# EAGLE design boiler25 (EAGLE 6.1)
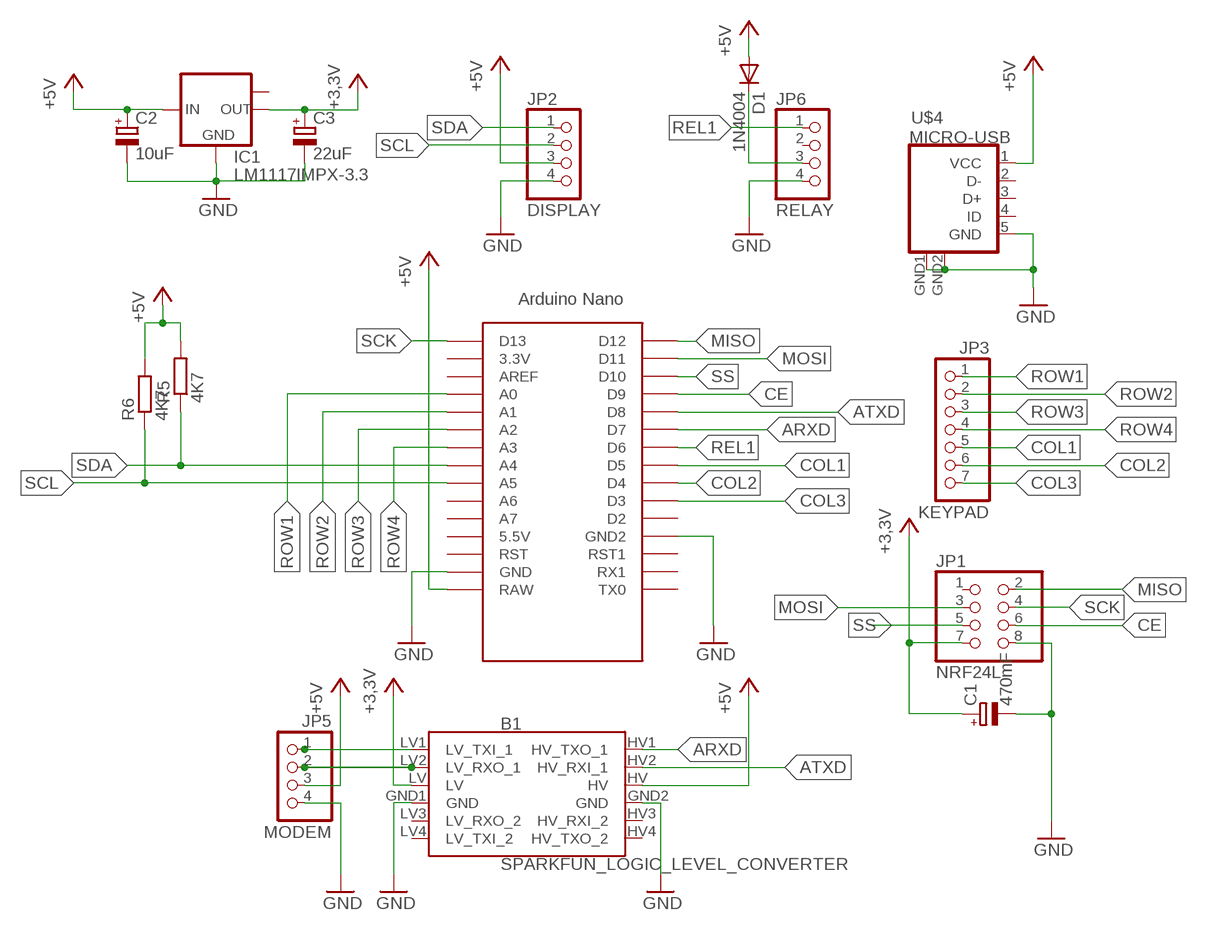
[diagram p0: schematic, sheet 1]

## Parts
B1  SPARKFUN_LOGIC_LEVEL_CONVERTER  [SPARKFUN_LOGIC_LEVEL_CONVERTER]
C1  470mF  CPOL-EUE3.5-8  [E3,5-8]
C2  10uF  CPOL-EUE1.8-4  [E1,8-4]
C3  22uF  CPOL-EUE1.8-4  [E1,8-4]
D1  1N4004  [DO41-10]
IC1  LM1117IMPX-3.3  [SOT223]
JP1  NRF24L  PINHD-2X4  [2X04]
JP2  DISPLAY  PINHD-1X4  [1X04]
JP3  KEYPAD  PINHD-1X7  [1X07]
JP5  MODEM  PINHD-1X4  [1X04]
JP6  RELAY  PINHD-1X4  [1X04]
R5  4K7  R-EU_M1206  [M1206]
R6  4K7  R-EU_M1206  [M1206]
U$4  MICRO-USB  [MICRO-USB]
U$5  NANO  [NANO]

## Nets
+3,3V: B1.LV C1.+ C3.+ IC1.2(OUT) JP1.7
+5V: B1.HV C2.+ D1.A IC1.3(IN) JP2.3 JP5.3 R5.2 R6.2 U$4.1(VCC) U$5.RAW
ARXD: B1.HV1(HV_TXO_1) U$5.D7
ATXD: B1.HV2(HV_RXI_1) U$5.D8
CE: JP1.6 U$5.D9
COL1: JP3.5 U$5.D5
COL2: JP3.6 U$5.D4
COL3: JP3.7 U$5.D3
GND: B1.GND1(GND) B1.GND2(GND) C1.- C2.- C3.- IC1.1(GND) JP1.8 JP2.4 JP5.4 JP6.4 U$4.5(GND) U$4.GND1(GND) U$4.GND2(GND) U$5.GND U$5.GND1(GND2)
MISO: JP1.2 U$5.D12
MOSI: JP1.3 U$5.D11
N$1: B1.LV1(LV_TXI_1) JP5.1
N$2: D1.C JP6.3
N$9: B1.LV2(LV_RXO_1) JP5.2
REL1: JP6.1 U$5.D6
ROW1: JP3.1 U$5.A0
ROW2: JP3.2 U$5.A1
ROW3: JP3.3 U$5.A2
ROW4: JP3.4 U$5.A3
SCK: JP1.4 U$5.D13
SCL: JP2.2 R6.1 U$5.A5
SDA: JP2.1 R5.1 U$5.A4
SS: JP1.5 U$5.D10
Unconnected: B1.HV3(HV_RXI_2) B1.HV4(HV_TXO_2) B1.LV3(LV_RXO_2) B1.LV4(LV_TXI_2) IC1.TAB(OUT1) JP1.1 JP6.2 U$4.2(D-) U$4.3(D+) U$4.4(ID) U$5.3.3V U$5.5V(5.5V) U$5.A6 U$5.A7 U$5.AREF U$5.D2 U$5.ICSP1 U$5.ICSP2 U$5.ICSP3 U$5.ICSP4 U$5.ICSP5 U$5.ICSP6 U$5.RST U$5.RST1 U$5.RX1 U$5.TX0

## Library data of the parts
B1 = SparkFun-Boards:SPARKFUN_LOGIC_LEVEL_CONVERTER: SparkFun Logic Level Converter -Bi-Directional This is the mechnical outline for the 3.3V - 5V bi directional logic level converter. SparkFun Products: SparkFun Logic Level Converter - Bi-Directional <https://www.sparkfun.com/products/12009>
C1-C3 = resistor:CPOL-EU: POLARIZED CAPACITOR, European symbol
D1 = diode:1N4004: DIODE general purpose rectifier, 1 A
IC1 = lm1117:LM1117IMPX-*
JP1 = pinhead:PINHD-2X4: PIN HEADER
JP2 JP5 JP6 = pinhead:PINHD-1X4: PIN HEADER
JP3 = pinhead:PINHD-1X7: PIN HEADER
R5 R6 = resistor:R-EU_: RESISTOR, European symbol
U$4 = microusb:MICRO-USB: Micro USB B connector
U$5 = Arduino-clone:NANO: Arduino Nano

## Board
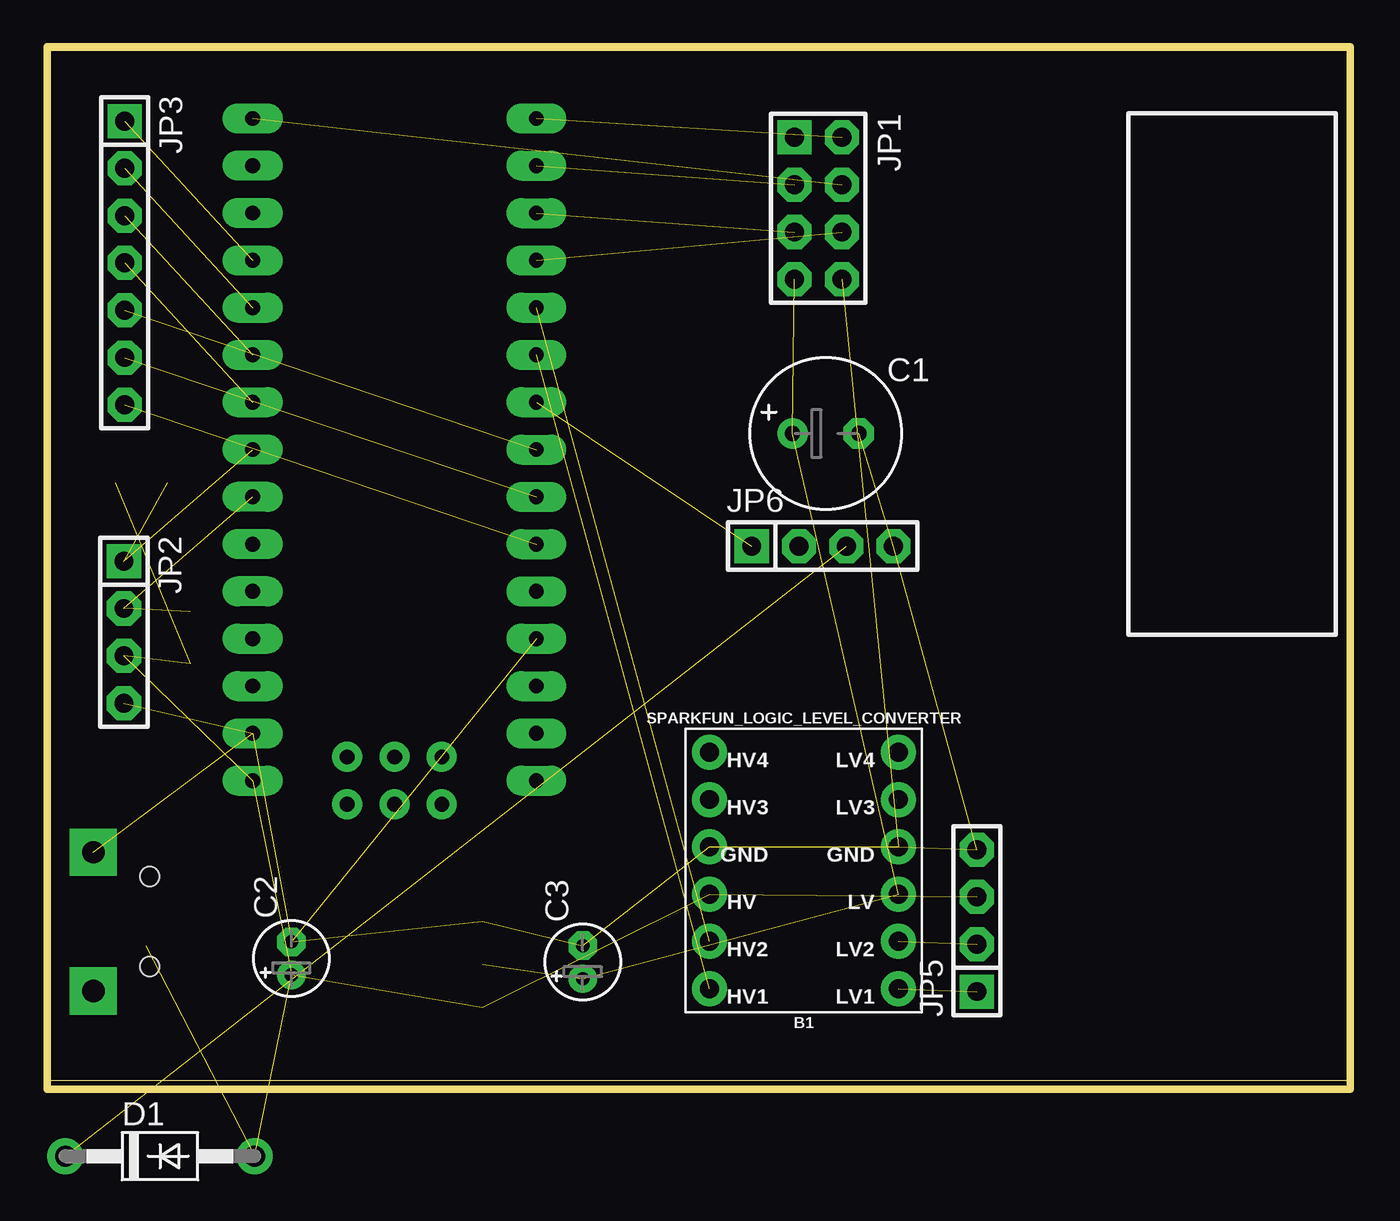
[diagram p1: board, top side]
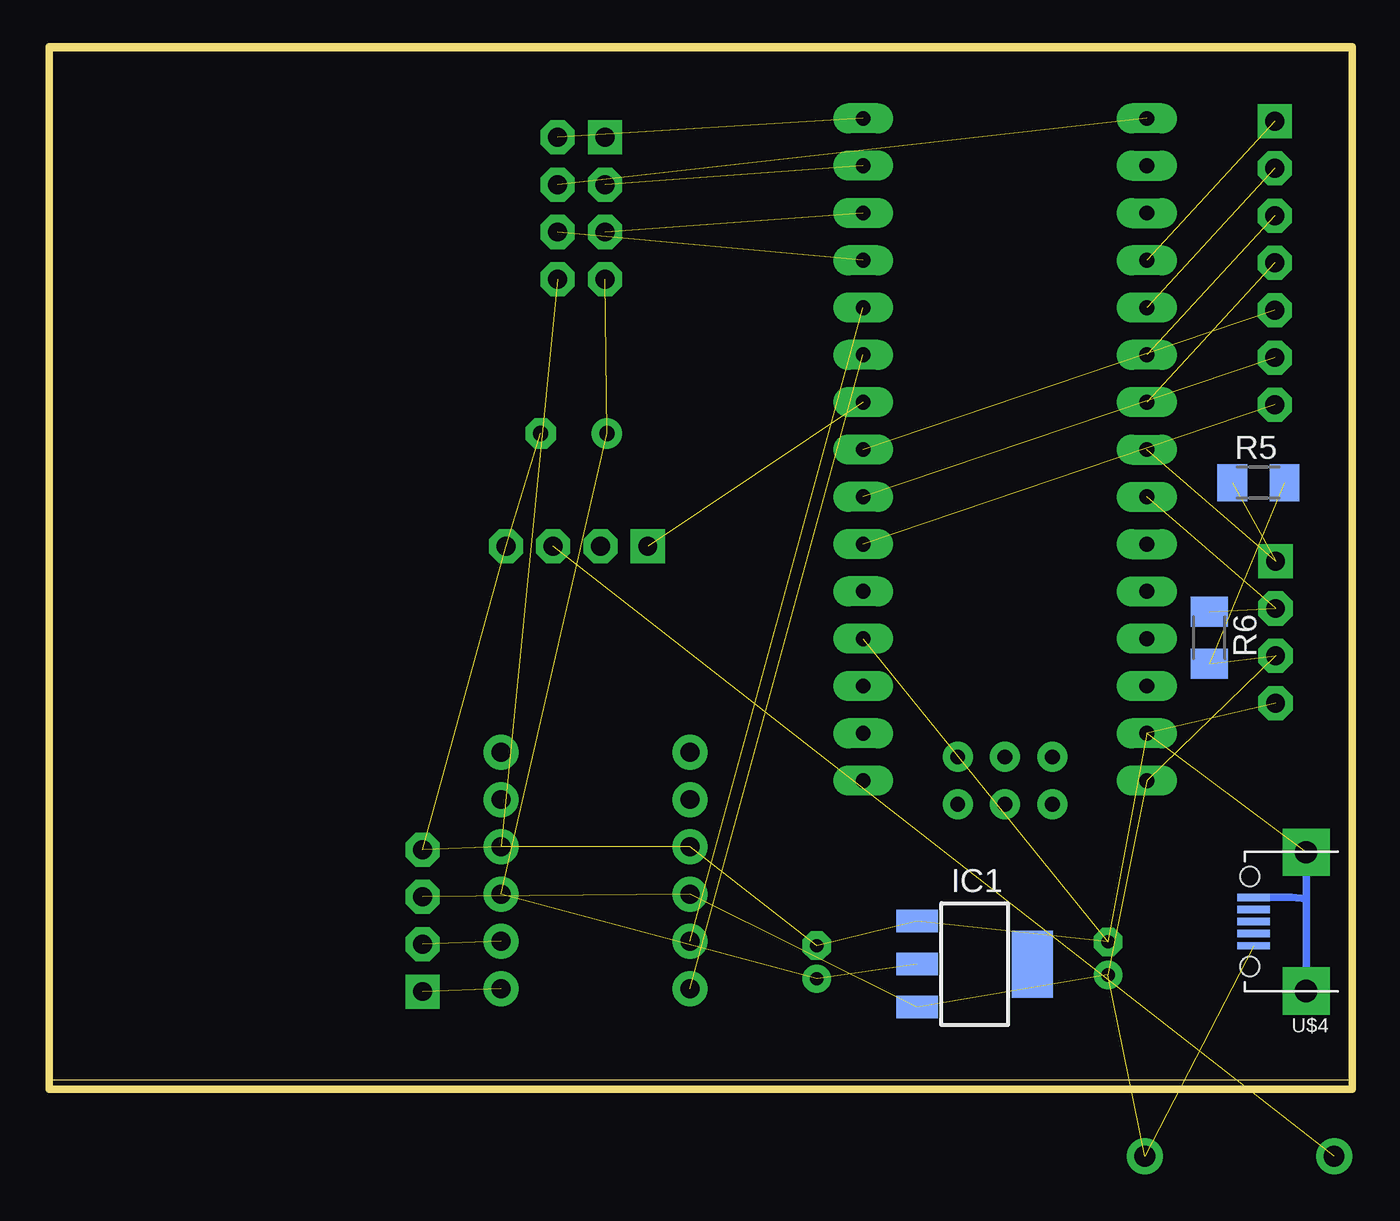
[diagram p2: board, bottom side, seen from below]

Size 70.19 x 56 mm. Coordinates in mm from the lower left corner, seen from the top.
Outline: 0,0.48 70.19,0.48 70.19,55.77 0,55.77 0,0.48
Outline: 0.04,56 70.04,56 70.04,0 0.04,0 0.04,56
Copper layers (1*16): Top 0.035mm / dielectric 1.5mm / Bottom 0.035mm
Design rules: minimum track width 4mil, minimum drill 0.2mm, track to track 18mil, track to pad 18mil, pad to pad 8mil, via to via 18mil, smd to smd 8mil, copper to edge 40mil, drill to drill 40mil, minimum pad ring 16mil, minimum via ring 8mil, stop-mask expansion 4mil, vias tented up to drill 0mil, thermal gap 10mil

### Footprints (pad centres in the part's own frame; a part is rotated, then mirrored left to right if it is on the bottom)
SPARKFUN_LOGIC_LEVEL_CONVERTER = drill 1.016 pad 1.88: GND1 -5.08,-1.27; GND2 5.08,-1.27; HV 5.08,1.27; HV1 5.08,6.35; HV2 5.08,3.81; HV3 5.08,-3.81; HV4 5.08,-6.35; LV -5.08,1.27; LV1 -5.08,6.35; LV2 -5.08,3.81; LV3 -5.08,-3.81; LV4 -5.08,-6.35
E3,5-8 = drill 0.813 pad 1.6: + -1.778,0 | drill 0.813 pad 1.6 octagon: - 1.778,0
E1,8-4 = drill 0.711 pad 1.168: + -0.889,0 | drill 0.711 pad 1.168 octagon: - 0.889,0
DO41-10 = drill 1.118: A 5.08,0; C -5.08,0
SOT223 = smd 1.219 x 2.235: 1 -2.311,-3.099; 2 0,-3.099; 3 2.311,-3.099 | smd 3.6 x 2.2: TAB 0,3.099
2X04 = drill 1.016 square: 1 -3.81,-1.27 | drill 1.016 octagon: 2 -3.81,1.27; 3 -1.27,-1.27; 4 -1.27,1.27; 5 1.27,-1.27; 6 1.27,1.27; 7 3.81,-1.27; 8 3.81,1.27
1X04 = drill 1.016 square: 1 -3.81,0 | drill 1.016 octagon: 2 -1.27,0; 3 1.27,0; 4 3.81,0
1X07 = drill 1.016 square: 1 -7.62,0 | drill 1.016 octagon: 2 -5.08,0; 3 -2.54,0; 4 0,0; 5 2.54,0; 6 5.08,0; 7 7.62,0
M1206 = smd 1.6 x 2: 1 -1.4,0; 2 1.4,0
MICRO-USB = smd 0.4 x 1.75: 1 -1.3,4.525; 2 -0.65,4.525; 3 0,4.525; 4 0.65,4.525; 5 1.3,4.525 | drill 1.2 pad 2.54 square: GND1 -3.725,1.7; GND2 3.725,1.7 | hole 1.05: -2.425,4.73; 2.425,4.73
NANO = drill 0.8 long: 3.3V -10.16,24.13; 5V -10.16,-1.27; A0 -10.16,19.05; A1 -10.16,16.51; A2 -10.16,13.97; A3 -10.16,11.43; A4 -10.16,8.89; A5 -10.16,6.35; A6 -10.16,3.81; A7 -10.16,1.27; AREF -10.16,21.59; D2 5.08,1.27; D3 5.08,3.81; D4 5.08,6.35; D5 5.08,8.89; D6 5.08,11.43; D7 5.08,13.97; D8 5.08,16.51; D9 5.08,19.05; D10 5.08,21.59; D11 5.08,24.13; D12 5.08,26.67; D13 -10.16,26.67; GND -10.16,-6.35; GND1 5.08,-1.27; RAW -10.16,-8.89; RST -10.16,-3.81; RST1 5.08,-3.81; RX1 5.08,-6.35; TX0 5.08,-8.89 | drill 0.8: ICSP1 -5.08,-10.16; ICSP2 -5.08,-7.62; ICSP3 -2.54,-10.16; ICSP4 -2.54,-7.62; ICSP5 0,-10.16; ICSP6 0,-7.62

### Placement (x,y rotation side)
B1  40.69,11.75 180 top
C1  41.86,35.22 0 top
C2  13.16,7.03 90 top
C3  28.8,6.83 90 top
D1  6.1,-3.59 0 top  (outside the outline)
IC1  20.32,6.72 270 bottom
JP1  41.45,47.31 270 top
JP2  4.16,24.55 270 top
JP3  4.2,44.38 270 top
JP5  49.99,9.06 90 top
JP6  41.7,29.17 0 top
R5  5.08,32.58 0 bottom
R6  7.72,24.25 270 bottom
U$4  0.81,9.01 90 bottom
U$5  21.23,25.47 0 top

### Tracks (layer width: path | path; a pad name or v marks a point on that pad's centre or on a via)
+3,3V  (4 unrouted)
+5V  (9 unrouted)
ARXD  (1 unrouted)
ATXD  (1 unrouted)
CE  (1 unrouted)
COL1  (1 unrouted)
COL2  (1 unrouted)
COL3  (1 unrouted)
GND  (12 unrouted)
  Bottom 0.406: U$4.GND2 2.51,10.23 | 2.51,10.23 U$4.GND1 | U$4.5 3.33,10.31 2.51,10.23
MISO  (1 unrouted)
MOSI  (1 unrouted)
N$1  (1 unrouted)
N$2  (1 unrouted)
N$9  (1 unrouted)
REL1  (1 unrouted)
ROW1  (1 unrouted)
ROW2  (1 unrouted)
ROW3  (1 unrouted)
ROW4  (1 unrouted)
SCK  (1 unrouted)
SCL  (2 unrouted)
SDA  (2 unrouted)
SS  (1 unrouted)